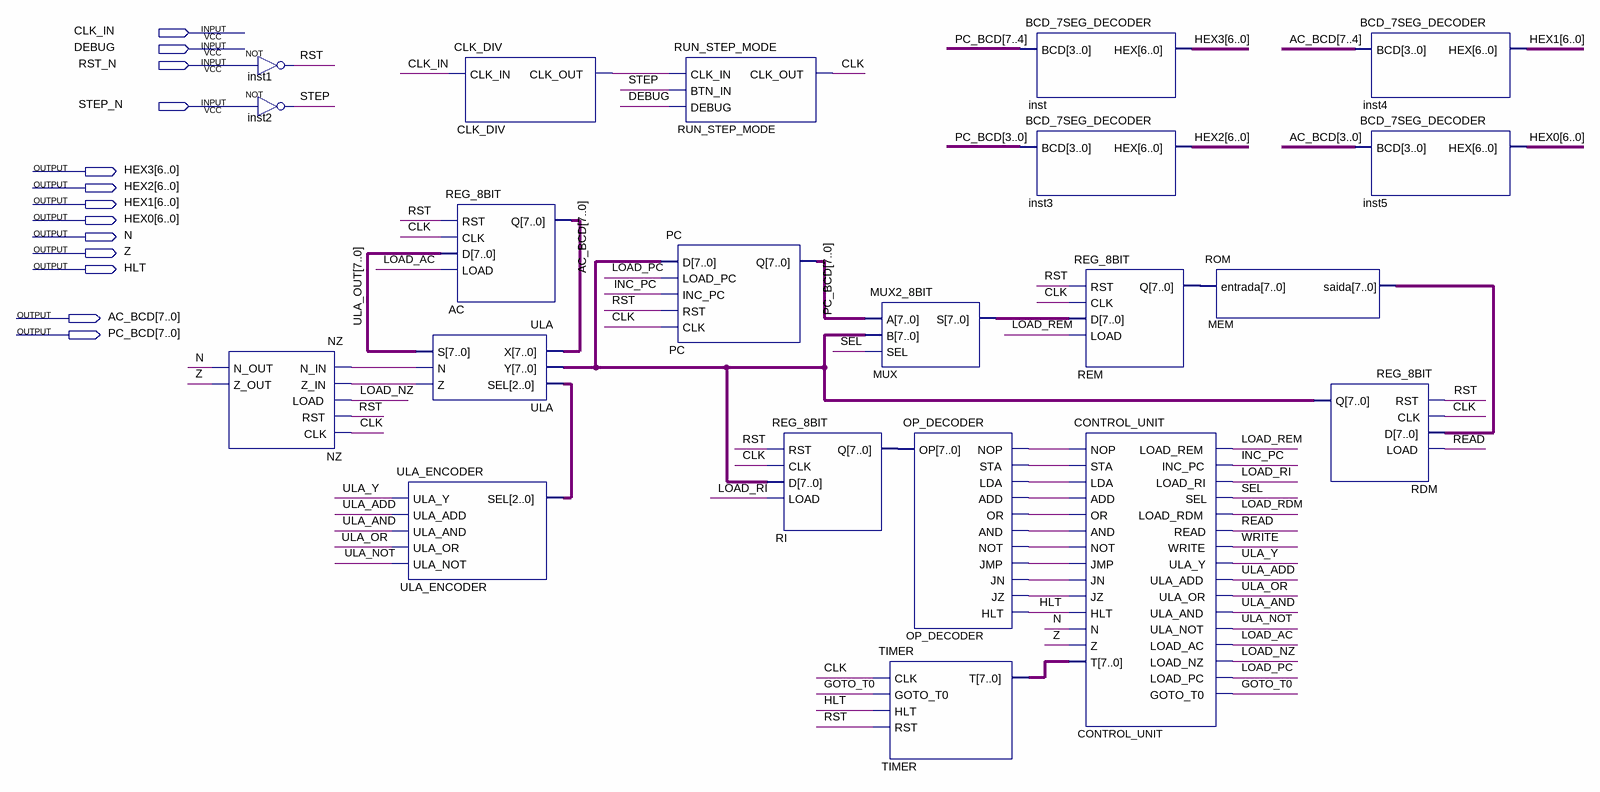
[diagram p0: schematic sheet]
// Quartus schematic NEANDER.bdf as structural Verilog: 21 symbols, 13 pins
module NEANDER (
  input  CLK_IN,
  input  DEBUG,
  input  RST_N,
  input  STEP_N,
  output [6:0] HEX3,
  output [6:0] HEX2,
  output [6:0] HEX1,
  output [6:0] HEX0,
  output N,
  output Z,
  output HLT,
  output [7:0] AC_BCD,
  output [7:0] PC_BCD
);

  wire CLK, CLK_DIV_clk_out, GOTO_T0, INC_PC, LOAD_AC, LOAD_NZ, LOAD_PC, LOAD_RDM, LOAD_REM, LOAD_RI,
       OP_DECODER_add, OP_DECODER_and, OP_DECODER_jmp, OP_DECODER_jn, OP_DECODER_jz, OP_DECODER_lda,
       OP_DECODER_nop, OP_DECODER_not, OP_DECODER_or, OP_DECODER_sta, READ, RST, SEL, STEP, ULA_ADD, ULA_AND,
       ULA_n, ULA_NOT, ULA_OR, ULA_Y, ULA_z, WRITE;
  wire [2:0] ULA_ENCODER_sel;
  wire [7:0] MEM_saida, MUX_s, RDM_q, REM_q, RI_q, TIMER_t, ULA_OUT;

  not inst1 (RST, RST_N);
  not inst2 (STEP, STEP_N);
  NZ NZ (.N_IN(ULA_n), .Z_IN(ULA_z), .LOAD(LOAD_NZ), .RST(RST), .CLK(CLK), .N_OUT(N), .Z_OUT(Z));
  ULA_ENCODER ULA_ENCODER (
    .ULA_Y(ULA_Y), .ULA_ADD(ULA_ADD), .ULA_AND(ULA_AND), .ULA_OR(ULA_OR), .ULA_NOT(ULA_NOT),
    .SEL(ULA_ENCODER_sel));
  CLK_DIV CLK_DIV (.CLK_IN(CLK_IN), .CLK_OUT(CLK_DIV_clk_out));
  REG_8BIT AC (.RST(RST), .CLK(CLK), .D(ULA_OUT), .LOAD(LOAD_AC), .Q(AC_BCD));
  ULA ULA (.X(AC_BCD), .Y(RDM_q), .SEL(ULA_ENCODER_sel), .S(ULA_OUT), .N(ULA_n), .Z(ULA_z));
  RUN_STEP_MODE RUN_STEP_MODE (.CLK_IN(CLK_DIV_clk_out), .BTN_IN(STEP), .DEBUG(DEBUG), .CLK_OUT(CLK));
  PC PC (.D(RDM_q), .LOAD_PC(LOAD_PC), .INC_PC(INC_PC), .RST(RST), .CLK(CLK), .Q(PC_BCD));
  REG_8BIT RI (.RST(RST), .CLK(CLK), .D(RDM_q), .LOAD(LOAD_RI), .Q(RI_q));
  MUX2_8BIT MUX (.A(PC_BCD), .B(RDM_q), .SEL(SEL), .S(MUX_s));
  OP_DECODER OP_DECODER (
    .OP(RI_q), .NOP(OP_DECODER_nop), .STA(OP_DECODER_sta), .LDA(OP_DECODER_lda), .ADD(OP_DECODER_add),
    .OR(OP_DECODER_or), .AND(OP_DECODER_and), .NOT(OP_DECODER_not), .JMP(OP_DECODER_jmp), .JN(OP_DECODER_jn),
    .JZ(OP_DECODER_jz), .HLT(HLT));
  TIMER TIMER (.CLK(CLK), .GOTO_T0(GOTO_T0), .HLT(HLT), .RST(RST), .T(TIMER_t));
  BCD_7SEG_DECODER inst (.BCD(PC_BCD[7:4]), .HEX(HEX3));
  BCD_7SEG_DECODER inst3 (.BCD(PC_BCD[3:0]), .HEX(HEX2));
  REG_8BIT REM (.RST(RST), .CLK(CLK), .D(MUX_s), .LOAD(LOAD_REM), .Q(REM_q));
  CONTROL_UNIT CONTROL_UNIT (
    .NOP(OP_DECODER_nop), .STA(OP_DECODER_sta), .LDA(OP_DECODER_lda), .ADD(OP_DECODER_add),
    .OR(OP_DECODER_or), .AND(OP_DECODER_and), .NOT(OP_DECODER_not), .JMP(OP_DECODER_jmp), .JN(OP_DECODER_jn),
    .JZ(OP_DECODER_jz), .HLT(HLT), .N(N), .Z(Z), .T(TIMER_t), .LOAD_REM(LOAD_REM), .INC_PC(INC_PC),
    .LOAD_RI(LOAD_RI), .SEL(SEL), .LOAD_RDM(LOAD_RDM), .READ(READ), .WRITE(WRITE), .ULA_Y(ULA_Y),
    .ULA_ADD(ULA_ADD), .ULA_OR(ULA_OR), .ULA_AND(ULA_AND), .ULA_NOT(ULA_NOT), .LOAD_AC(LOAD_AC),
    .LOAD_NZ(LOAD_NZ), .LOAD_PC(LOAD_PC), .GOTO_T0(GOTO_T0));
  ROM MEM (.entrada(REM_q), .saida(MEM_saida));
  BCD_7SEG_DECODER inst4 (.BCD(AC_BCD[7:4]), .HEX(HEX1));
  BCD_7SEG_DECODER inst5 (.BCD(AC_BCD[3:0]), .HEX(HEX0));
  REG_8BIT RDM (.RST(RST), .CLK(CLK), .D(MEM_saida), .LOAD(READ), .Q(RDM_q));
endmodule
